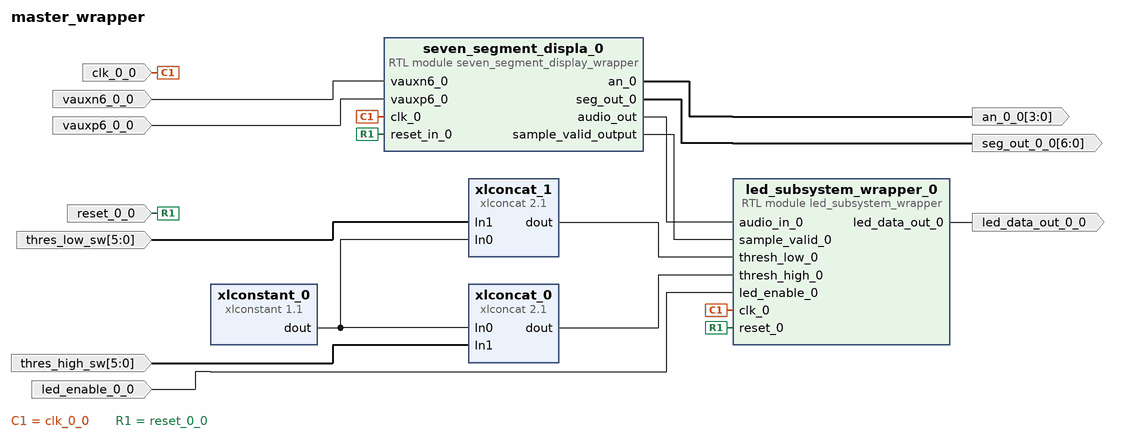
[diagram p0: block diagram of the top level]
# Vivado block design master_wrapper, xc7a35tcpg236-1, Vivado 2025.2
create_bd_design master_wrapper

create_bd_port -dir I clk_0_0
create_bd_port -dir I -type rst reset_0_0
create_bd_port -dir I vauxn6_0_0
create_bd_port -dir I vauxp6_0_0
create_bd_port -dir I -from 5 -to 0 thres_high_sw
create_bd_port -dir I -from 5 -to 0 thres_low_sw
create_bd_port -dir I led_enable_0_0
create_bd_port -dir O led_data_out_0_0
create_bd_port -dir O -from 3 -to 0 an_0_0
create_bd_port -dir O -from 6 -to 0 seg_out_0_0

create_bd_cell -type module -reference seven_segment_display_wrapper seven_segment_displa_0
create_bd_cell -type module -reference led_subsystem_wrapper led_subsystem_wrapper_0
create_bd_cell -type ip -vlnv xilinx.com:ip:xlconcat:2.1 xlconcat_0
set_property -dict {CONFIG.IN0_WIDTH 6 CONFIG.IN1_WIDTH 6} [get_bd_cells xlconcat_0]
create_bd_cell -type ip -vlnv xilinx.com:ip:xlconstant:1.1 xlconstant_0
set_property -dict {CONFIG.CONST_VAL 0 CONFIG.CONST_WIDTH 6} [get_bd_cells xlconstant_0]
create_bd_cell -type ip -vlnv xilinx.com:ip:xlconcat:2.1 xlconcat_1
set_property -dict {CONFIG.IN0_WIDTH 6 CONFIG.IN1_WIDTH 6} [get_bd_cells xlconcat_1]

# ---- connections ----

connect_bd_net -net clk_0_0_1 [get_bd_ports clk_0_0] [get_bd_pins led_subsystem_wrapper_0/clk_0] [get_bd_pins seven_segment_displa_0/clk_0]
connect_bd_net -net led_enable_0_0_1 [get_bd_ports led_enable_0_0] [get_bd_pins led_subsystem_wrapper_0/led_enable_0]
connect_bd_net [get_bd_pins led_subsystem_wrapper_0/led_data_out_0] [get_bd_ports led_data_out_0_0]
connect_bd_net -net reset_0_0_1 [get_bd_ports reset_0_0] [get_bd_pins led_subsystem_wrapper_0/reset_0] [get_bd_pins seven_segment_displa_0/reset_in_0]
connect_bd_net [get_bd_pins seven_segment_displa_0/an_0] [get_bd_ports an_0_0]
connect_bd_net [get_bd_pins seven_segment_displa_0/audio_out] [get_bd_pins led_subsystem_wrapper_0/audio_in_0]
connect_bd_net [get_bd_pins seven_segment_displa_0/sample_valid_output] [get_bd_pins led_subsystem_wrapper_0/sample_valid_0]
connect_bd_net [get_bd_pins seven_segment_displa_0/seg_out_0] [get_bd_ports seg_out_0_0]
connect_bd_net [get_bd_ports thres_high_sw] [get_bd_pins xlconcat_0/In1]
connect_bd_net [get_bd_ports thres_low_sw] [get_bd_pins xlconcat_1/In1]
connect_bd_net -net vauxn6_0_0_1 [get_bd_ports vauxn6_0_0] [get_bd_pins seven_segment_displa_0/vauxn6_0]
connect_bd_net -net vauxp6_0_0_1 [get_bd_ports vauxp6_0_0] [get_bd_pins seven_segment_displa_0/vauxp6_0]
connect_bd_net [get_bd_pins xlconcat_0/dout] [get_bd_pins led_subsystem_wrapper_0/thresh_high_0]
connect_bd_net [get_bd_pins xlconcat_1/dout] [get_bd_pins led_subsystem_wrapper_0/thresh_low_0]
connect_bd_net [get_bd_pins xlconstant_0/dout] [get_bd_pins xlconcat_0/In0] [get_bd_pins xlconcat_1/In0]

validate_bd_design
save_bd_design
